# EAGLE design strip (EAGLE 5.00)
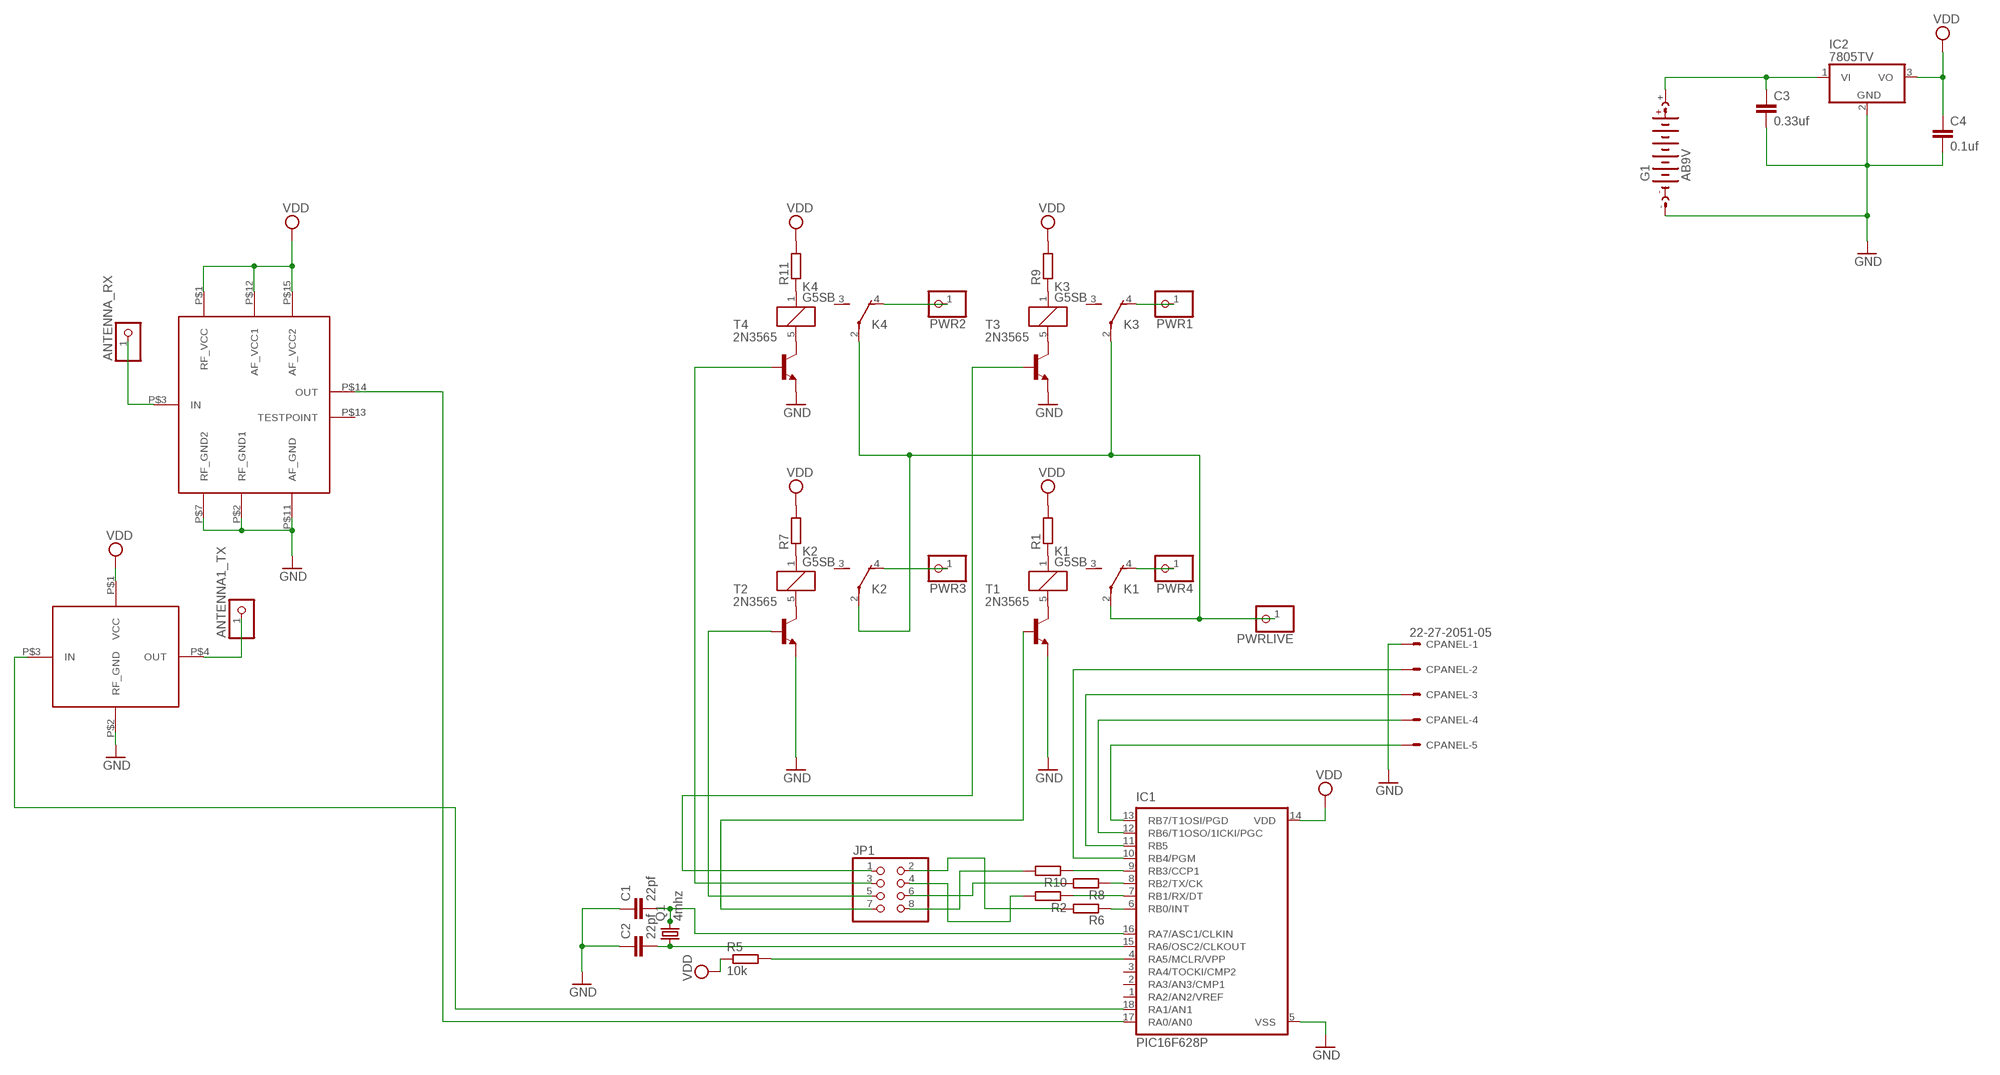
[diagram p0: schematic, sheet 1]

## Parts
ANTENNA1_TX  PINHD-1X1  [1X01]
ANTENNA_RX  PINHD-1X1  [1X01]
C1  22pf  C-EU075-032X103  [C075-032X103]
C2  22pf  C-EU075-032X103  [C075-032X103]
C3  0.33uf  C5/3  [C5B3]
C4  0.1uf  C5/3  [C5B3]
CPANEL  22-27-2051-05  [6410-05]
G1  AB9V  [AB9V]
IC1  PIC16F628P  [DIL18]
IC2  7805TV  [TO220V]
JP1  PINHD-2X4  [2X04]
K1  G5SB  [G5SB]
K2  G5SB  [G5SB]
K3  G5SB  [G5SB]
K4  G5SB  [G5SB]
PWR1  PINHD-1X1  [1X01]
PWR2  PINHD-1X1  [1X01]
PWR3  PINHD-1X1  [1X01]
PWR4  PINHD-1X1  [1X01]
PWRLIVE  PINHD-1X1  [1X01]
Q1  4mhz  CRYSTALHC49S  [HC49/S]
R1  R-EU_0207/7  [0207/7]
R2  R-EU_0207/7  [0207/7]
R5  10k  R-EU_0207/5V  [0207/5V]
R6  R-EU_0207/7  [0207/7]
R7  R-EU_0207/7  [0207/7]
R8  R-EU_0207/7  [0207/7]
R9  R-EU_0207/7  [0207/7]
R10  R-EU_0207/7  [0207/7]
R11  R-EU_0207/7  [0207/7]
T1  2N3565  [TO92]
T2  2N3565  [TO92]
T3  2N3565  [TO92]
T4  2N3565  [TO92]
U$1  RR4  [SIL15]
U$2  RR5  [DIL4]

## Nets
9V: C3.1 G1.+ IC2.1(VI)
ANTENNA: ANTENNA_RX.1 U$1.P$3(IN)
GND: C1.1 C2.1 C3.2 C4.2 CPANEL.1 G1.- IC1.5(VSS) IC2.2(GND) T1.3(E) T2.3(E) T3.3(E) T4.3(E) U$1.P$2(RF_GND1) U$1.P$7(RF_GND2) U$1.P$11(AF_GND) U$2.P$2(RF_GND)
N$1: C1.2 IC1.16(RA7/ASC1/CLKIN) Q1.2
N$2: C2.2 IC1.15(RA6/OSC2/CLKOUT) Q1.1
N$3: JP1.3 T4.2(B)
N$4: K1.5 T1.1(C)
N$5: IC1.6(RB0/INT) R6.1
N$6: IC1.9(RB3/CCP1) R10.1
N$7: K1.1 R1.1
N$8: JP1.5 T2.2(B)
N$9: IC1.4(RA5/MCLR/VPP) R5.2
N$10: K2.5 T2.1(C)
N$11: JP1.7 T1.2(B)
N$12: JP1.8 R10.2
N$13: IC1.17(RA0/AN0) U$1.P$14(OUT)
N$14: K2.1 R7.1
N$15: ANTENNA1_TX.1 U$2.P$4(OUT)
N$16: IC1.18(RA1/AN1) U$2.P$3(IN)
N$17: JP1.6 R8.2
N$18: K3.5 T3.1(C)
N$19: JP1.2 R6.2
N$20: IC1.8(RB2/TX/CK) R8.1
N$21: K3.1 R9.1
N$22: JP1.4 R2.2
N$23: K4.5 T4.1(C)
N$25: IC1.7(RB1/RX/DT) R2.1
N$26: K4.1 R11.1
N$27: K1.2(U:P) K2.2(U:P) K3.2(U:P) K4.2(U:P) PWRLIVE.1
N$29: CPANEL.5 IC1.13(RB7/T1OSI/PGD)
N$30: K2.4(U:O) PWR3.1
N$31: K1.4(U:O) PWR4.1
N$32: CPANEL.4 IC1.12(RB6/T1OSO/1ICKI/PGC)
N$33: CPANEL.3 IC1.11(RB5)
N$34: CPANEL.2 IC1.10(RB4/PGM)
N$35: JP1.1 T3.2(B)
PWR1: K4.4(U:O) PWR2.1
PWR2: K3.4(U:O) PWR1.1
VDD: C4.1 IC1.14(VDD) IC2.3(VO) R1.2 R5.1 R7.2 R9.2 R11.2 U$1.P$1(RF_VCC) U$1.P$12(AF_VCC1) U$1.P$15(AF_VCC2) U$2.P$1(VCC)
Unconnected: IC1.1(RA2/AN2/VREF) IC1.2(RA3/AN3/CMP1) IC1.3(RA4/TOCKI/CMP2) K1.3(U:S) K2.3(U:S) K3.3(U:S) K4.3(U:S) U$1.P$13(TESTPOINT)

## Library data of the parts
ANTENNA1_TX ANTENNA_RX PWR1-PWR4 PWRLIVE = pinhead:PINHD-1X1: PIN HEADER
C1 C2 = resistor:C-EU: CAPACITOR, European symbol
C3 C4 = capacitor-wima:C: CAPACITOR naming: grid - package width
CPANEL = con-molex:22-?-05: CONNECTOR wire to board 2.54 mm (.1 inch) pitch header
G1 = battery:AB9V: 9-V BATTERY CLIP
IC1 = microchip:PIC16*F62: FLASH-Based 8-Bit CMOS Microcontroller Source: http://ww1.microchip.com/downloads/en/DeviceDoc/40300C.pdf
IC2 = linear:78*: Positive VOLTAGE REGULATOR Source: http://cache.national.com/ds/LM/LM78L05.pdf http://www.fairchildsemi.com/ds/LM/LM7805.pdf
JP1 = pinhead:PINHD-2X4: PIN HEADER
K1-K4 = relay:G5SB: Compact Single-pole Relay for Switching 5 A Source: http://www.omron.com/ecb/products/pry/121/g5sb.html
Q1 = crystal:CRYSTAL: CRYSTAL
R1 R2 R5-R11 = rcl:R-EU_: RESISTOR, European symbol
T1-T4 = transistor:2N3565: NPN TRANSISTOR
U$1 = rf:RR4
U$2 = rf:RR5

## Board
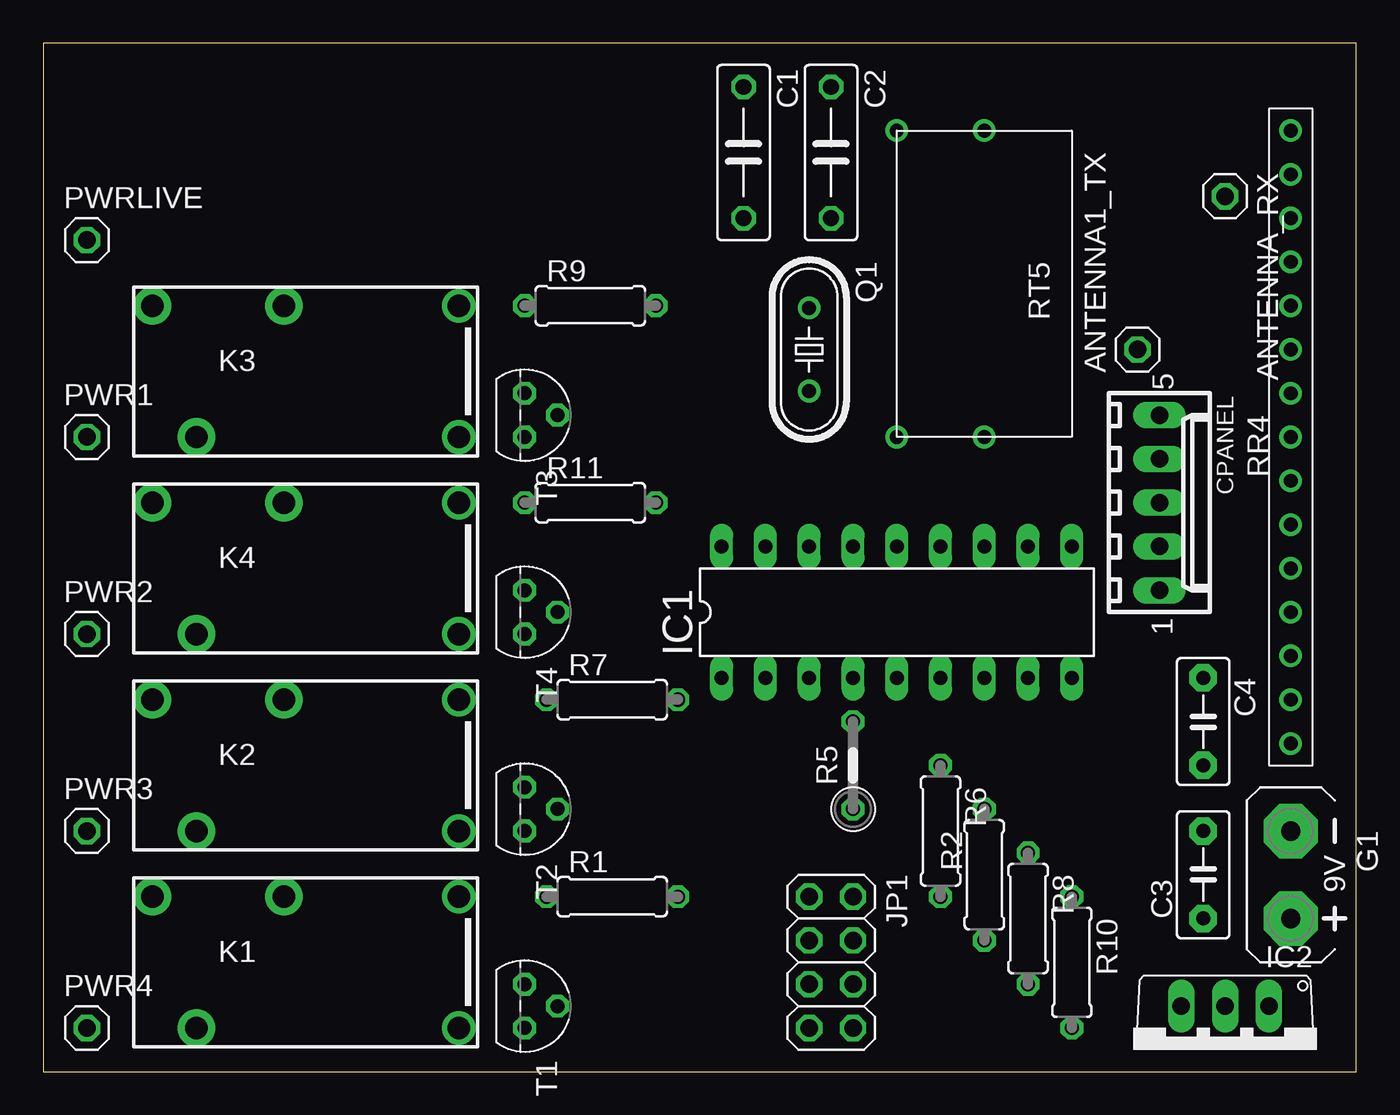
[diagram p1: board, top side]
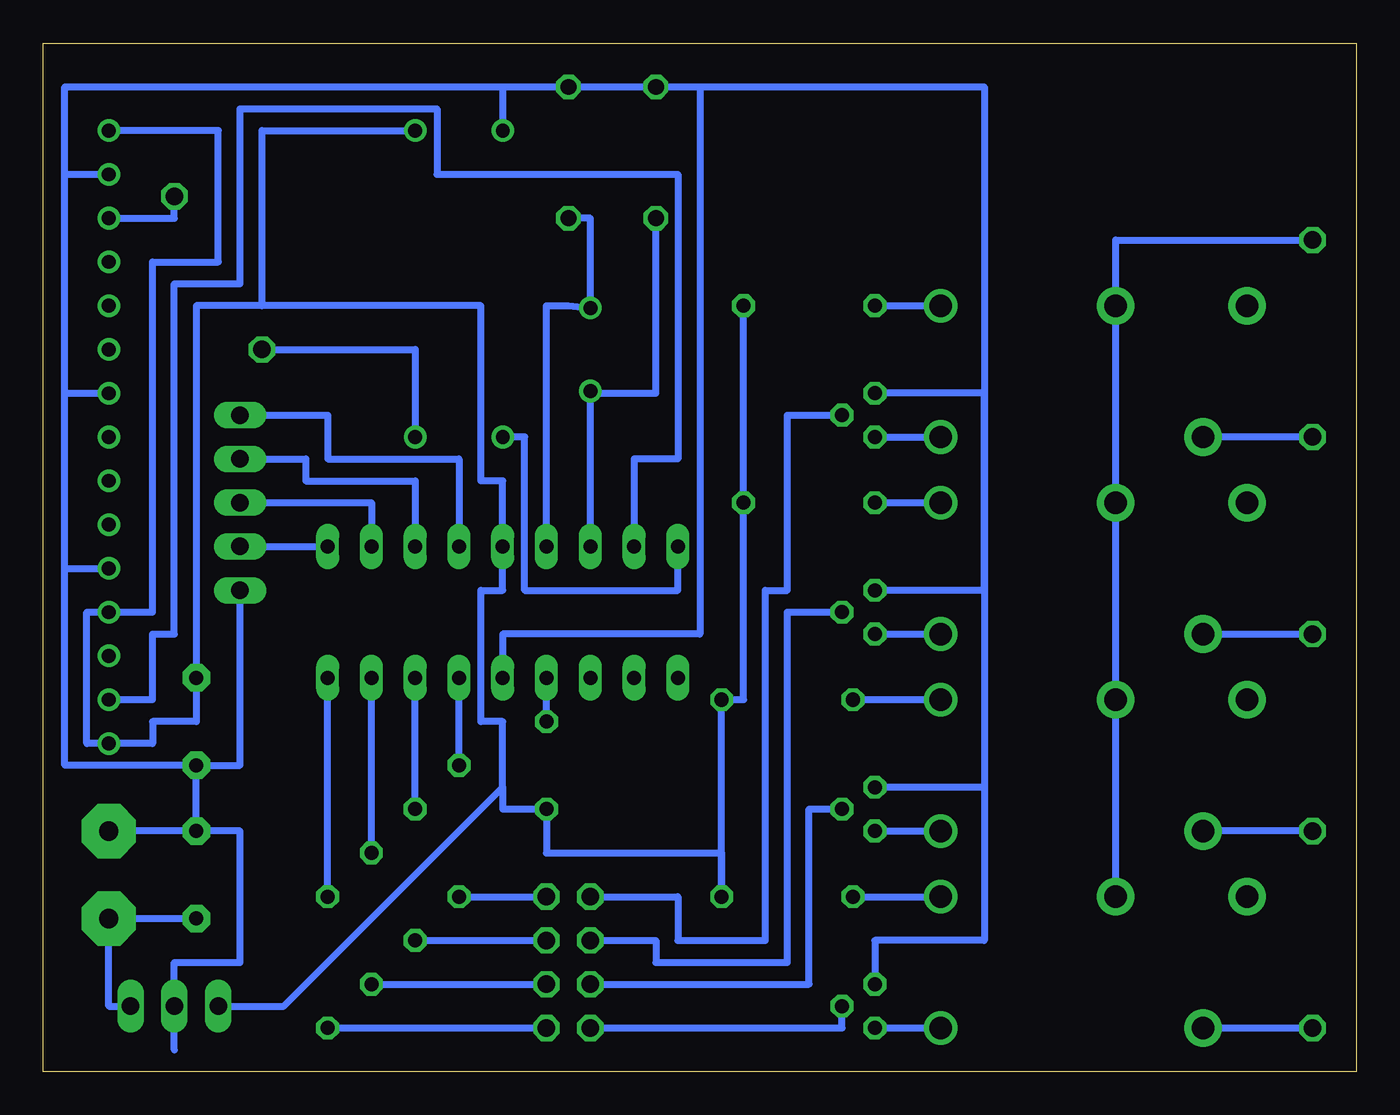
[diagram p2: board, bottom side, seen from below]

Size 76.2 x 59.69 mm. Coordinates in mm from the lower left corner, seen from the top.
Outline: 76.2,0 76.2,59.69 0,59.69 0,0 76.2,0
Copper layers (1*16): Top 0.035mm / dielectric 1.5mm / Bottom 0.035mm
Design rules "default": minimum track width 10mil, minimum drill 24mil, track to track 8mil, track to pad 8mil, pad to pad 8mil, via to via 8mil, smd to smd 8mil, copper to edge 40mil, drill to drill 8mil, minimum pad ring 10mil, minimum via ring 8mil, stop-mask expansion 4mil, vias tented up to drill 0mil, thermal gap 10mil

### Footprints (pad centres in the part's own frame; a part is rotated, then mirrored left to right if it is on the bottom)
1X01 = drill 1.016 octagon: 1 0,0
C075-032X103 = drill 0.914 octagon: 1 -3.81,0; 2 3.81,0
C5B3 = drill 0.813 pad 1.6 octagon: 1 -2.54,0; 2 2.54,0
6410-05 = drill 1.016 long: 1 5.08,0; 2 2.54,0; 3 0,0; 4 -2.54,0; 5 -5.08,0
AB9V = drill 1.118 pad 3.15 octagon: + 0,2.54; - 0,-2.54
DIL18 = drill 0.813 long: 1 -10.16,-3.81; 2 -7.62,-3.81; 3 -5.08,-3.81; 4 -2.54,-3.81; 5 0,-3.81; 6 2.54,-3.81; 7 5.08,-3.81; 8 7.62,-3.81; 9 10.16,-3.81; 10 10.16,3.81; 11 7.62,3.81; 12 5.08,3.81; 13 2.54,3.81; 14 0,3.81; 15 -2.54,3.81; 16 -5.08,3.81; 17 -7.62,3.81; 18 -10.16,3.81
TO220V = drill 1.016 long: 1 -2.54,-2.54; 2 0,-2.54; 3 2.54,-2.54
2X04 = drill 1.016 octagon: 1 -3.81,-1.27; 2 -3.81,1.27; 3 -1.27,-1.27; 4 -1.27,1.27; 5 1.27,-1.27; 6 1.27,1.27; 7 3.81,-1.27; 8 3.81,1.27
G5SB = drill 1.3 pad 1.93 round: 1 7.62,3.81; 5 7.62,-3.81 | drill 1.3 pad 2.184 round: 2 -2.54,3.81; 3 -10.16,3.81; 4 -7.62,-3.81
HC49/S = drill 0.813 round: 1 -2.413,0; 2 2.413,0
0207/7 = drill 0.813 octagon: 1 -3.81,0; 2 3.81,0
0207/5V = drill 0.813 octagon: 1 -2.54,0; 2 2.54,0
TO92 = drill 0.813 octagon: 1 1.27,0; 2 0,1.905; 3 -1.27,0
SIL15 = drill 0.8 round: P$1 -17.78,0; P$2 -15.24,0; P$3 -12.7,0; P$4 -10.16,0; P$5 -7.62,0; P$6 -5.08,0; P$7 -2.54,0; P$8 0,0; P$9 2.54,0; P$10 5.08,0; P$11 7.62,0; P$12 10.16,0; P$13 12.7,0; P$14 15.24,0; P$15 17.78,0
DIL4 = drill 0.8 round: P$1 -8.89,0; P$2 -8.89,-5.08; P$3 8.89,-5.08; P$4 8.89,0

### Placement (x,y rotation side)
ANTENNA1_TX  63.5,41.91 90 top
ANTENNA_RX  68.58,50.8 270 top
C1  40.64,53.34 270 top
C2  45.72,53.34 270 top
C3  67.31,11.43 90 top
C4  67.31,20.32 270 top
CPANEL  64.77,33.02 270 top
G1  72.39,11.43 180 top
IC1  49.53,26.67 0 top
IC2  68.58,1.27 180 top
JP1  45.72,6.35 270 top
K1  16.51,6.35 0 top
K2  16.51,17.78 0 top
K3  16.51,40.64 0 top
K4  16.51,29.21 0 top
PWR1  2.54,36.83 0 top
PWR2  2.54,25.4 0 top
PWR3  2.54,13.97 0 top
PWR4  2.54,2.54 0 top
PWRLIVE  2.54,48.26 0 top
Q1  44.45,41.91 270 top
R1  33.02,10.16 0 top
R2  54.61,11.43 270 top
R5  46.99,17.78 90 top
R6  52.07,13.97 270 top
R7  33.02,21.59 0 top
R8  57.15,8.89 270 top
R9  31.75,44.45 0 top
R10  59.69,6.35 270 top
R11  31.75,33.02 0 top
T1  27.94,3.81 270 top
T2  27.94,15.24 270 top
T3  27.94,38.1 270 top
T4  27.94,26.67 270 top
U$1  72.39,36.83 270 top
U$2  54.61,45.72 270 top

### Tracks (layer width: path | path; a pad name or v marks a point on that pad's centre or on a via)
9V
  Bottom 0.406: IC2.1 72.39,3.81 G1.+ C3.1
ANTENNA
  Bottom 0.406: U$1.P$3 68.58,49.53 ANTENNA_RX.1
GND
  Bottom 0.406: 68.58,1.27 IC2.2 68.58,6.35 64.77,6.35 64.77,13.97 C3.2 | C3.2 G1.- | C3.2 C4.2 | C4.2 74.93,17.78 74.93,29.21 | 74.93,29.21 U$1.P$11 | 74.93,39.37 U$1.P$7 | 74.93,29.21 74.93,39.37 | 74.93,52.07 U$1.P$2 | 74.93,39.37 74.93,52.07 | 74.93,52.07 74.93,57.15 49.53,57.15 | 49.53,57.15 C2.1 C1.1 38.1,57.15 | T1.3 27.94,7.62 21.59,7.62 21.59,16.51 | 21.59,16.51 T2.3 | T3.3 21.59,39.37 21.59,27.94 | 38.1,57.15 21.59,57.15 21.59,27.94 | 49.53,57.15 U$2.P$2 | IC1.5 49.53,25.4 38.1,25.4 38.1,57.15 | CPANEL.1 64.77,17.78 C4.2 | 21.59,27.94 T4.3 | 21.59,27.94 21.59,16.51
N$1
  Bottom 0.406: IC1.16 44.45,39.37 | 44.45,39.37 Q1.2 | 44.45,39.37 40.64,39.37 C1.2
N$2
  Bottom 0.406: C2.2 44.45,49.53 Q1.1 45.72,44.45 46.99,44.45 IC1.15
N$3
  Bottom 0.406: T4.2 33.02,26.67 33.02,6.35 40.64,6.35 40.64,7.62 JP1.3
N$4
  Bottom 0.406: T1.1 K1.5
N$5
  Bottom 0.406: R6.1 IC1.6
N$6
  Bottom 0.406: R10.1 IC1.9
N$7
  Bottom 0.406: R1.1 K1.1
N$8
  Bottom 0.406: T2.2 31.75,15.24 31.75,5.08 JP1.5
N$9
  Bottom 0.406: R5.2 IC1.4
N$10
  Bottom 0.406: T2.1 K2.5
N$11
  Bottom 0.406: T1.2 29.84,2.54 JP1.7
N$12
  Bottom 0.406: R10.2 JP1.8
N$13
  Bottom 0.406: U$1.P$14 69.85,21.59 69.85,25.4 68.58,25.4 68.58,45.72 64.77,45.72 64.77,55.88 53.34,55.88 53.34,52.07 39.37,52.07 39.37,35.56 41.91,35.56 IC1.17
N$14
  Bottom 0.406: R7.1 K2.1
N$15
  Bottom 0.406: U$2.P$4 54.61,41.91 ANTENNA1_TX.1
N$16
  Bottom 0.406: U$2.P$3 48.26,36.83 48.26,27.94 39.37,27.94 IC1.18
N$17
  Bottom 0.406: R8.2 JP1.6
N$18
  Bottom 0.406: T3.1 K3.5
N$19
  Bottom 0.406: R6.2 JP1.2
N$20
  Bottom 0.406: R8.1 IC1.8
N$21
  Bottom 0.406: R9.1 K3.1
N$22
  Bottom 0.406: R2.2 JP1.4
N$23
  Bottom 0.406: T4.1 K4.5
N$25
  Bottom 0.406: R2.1 IC1.7
N$26
  Bottom 0.406: R11.1 K4.1
N$27
  Bottom 0.406: K1.2 K2.2 K4.2 K3.2 13.97,48.26 PWRLIVE.1
N$29
  Bottom 0.406: IC1.13 52.07,35.56 59.69,35.56 59.69,38.1 CPANEL.5
N$30
  Bottom 0.406: PWR3.1 K2.4
N$31
  Bottom 0.406: K1.4 PWR4.1
N$32
  Bottom 0.406: IC1.12 54.61,34.29 60.96,34.29 60.96,35.56 CPANEL.4
N$33
  Bottom 0.406: IC1.11 57.15,33.02 CPANEL.3
N$34
  Bottom 0.406: CPANEL.2 IC1.10
N$35
  Bottom 0.406: T3.2 33.02,38.1 33.02,27.94 34.29,27.94 34.29,7.62 39.37,7.62 39.37,10.16 JP1.1
PWR1
  Bottom 0.406: K4.4 PWR2.1
PWR2
  Bottom 0.406: PWR1.1 K3.4
VDD
  Bottom 0.406: U$1.P$1 66.04,54.61 66.04,46.99 69.85,46.99 69.85,26.67 U$1.P$12 73.66,26.67 73.66,19.05 U$1.P$15 69.85,19.05 69.85,20.32 67.31,20.32 C4.1 67.31,44.45 63.5,44.45 | U$2.P$1 63.5,54.61 63.5,44.45 | 49.53,16.51 49.53,20.32 50.8,20.32 50.8,27.94 49.53,27.94 IC1.14 49.53,34.29 50.8,34.29 50.8,44.45 63.5,44.45 | 49.53,16.51 49.53,15.24 R5.1 46.99,12.7 36.83,12.7 R1.2 R7.2 35.56,21.59 R11.2 R9.2 | IC2.3 62.23,3.81 49.53,16.51